# Altium schematic sheet 425AK01A_S01.SchDoc
size A3; DocumentNumber: 1; SheetNumber: 1; SheetTotal: 10; PageSetup: Record=PageOptions|CenterHorizontal=True|CenterVertical=True|PrintScale=1.01|XCorrection=1.00|YCorrection=1.00|PrintKind=1|BorderSize=5000000|LeftOffset=0|BottomOffset=0|Orientation=2|PaperLength=1000|PaperWidth=1000|Scale=100|PaperSource=15|PrintQuality=600|MediaType=1|DitherType=10|PaperKind=A3|PrintScaleMode=1; 00_Drawn: RJG; 00_Date: 8APR2022; 00_Checked: SR; 00_Approved: GN; 00_Line1: Top Level
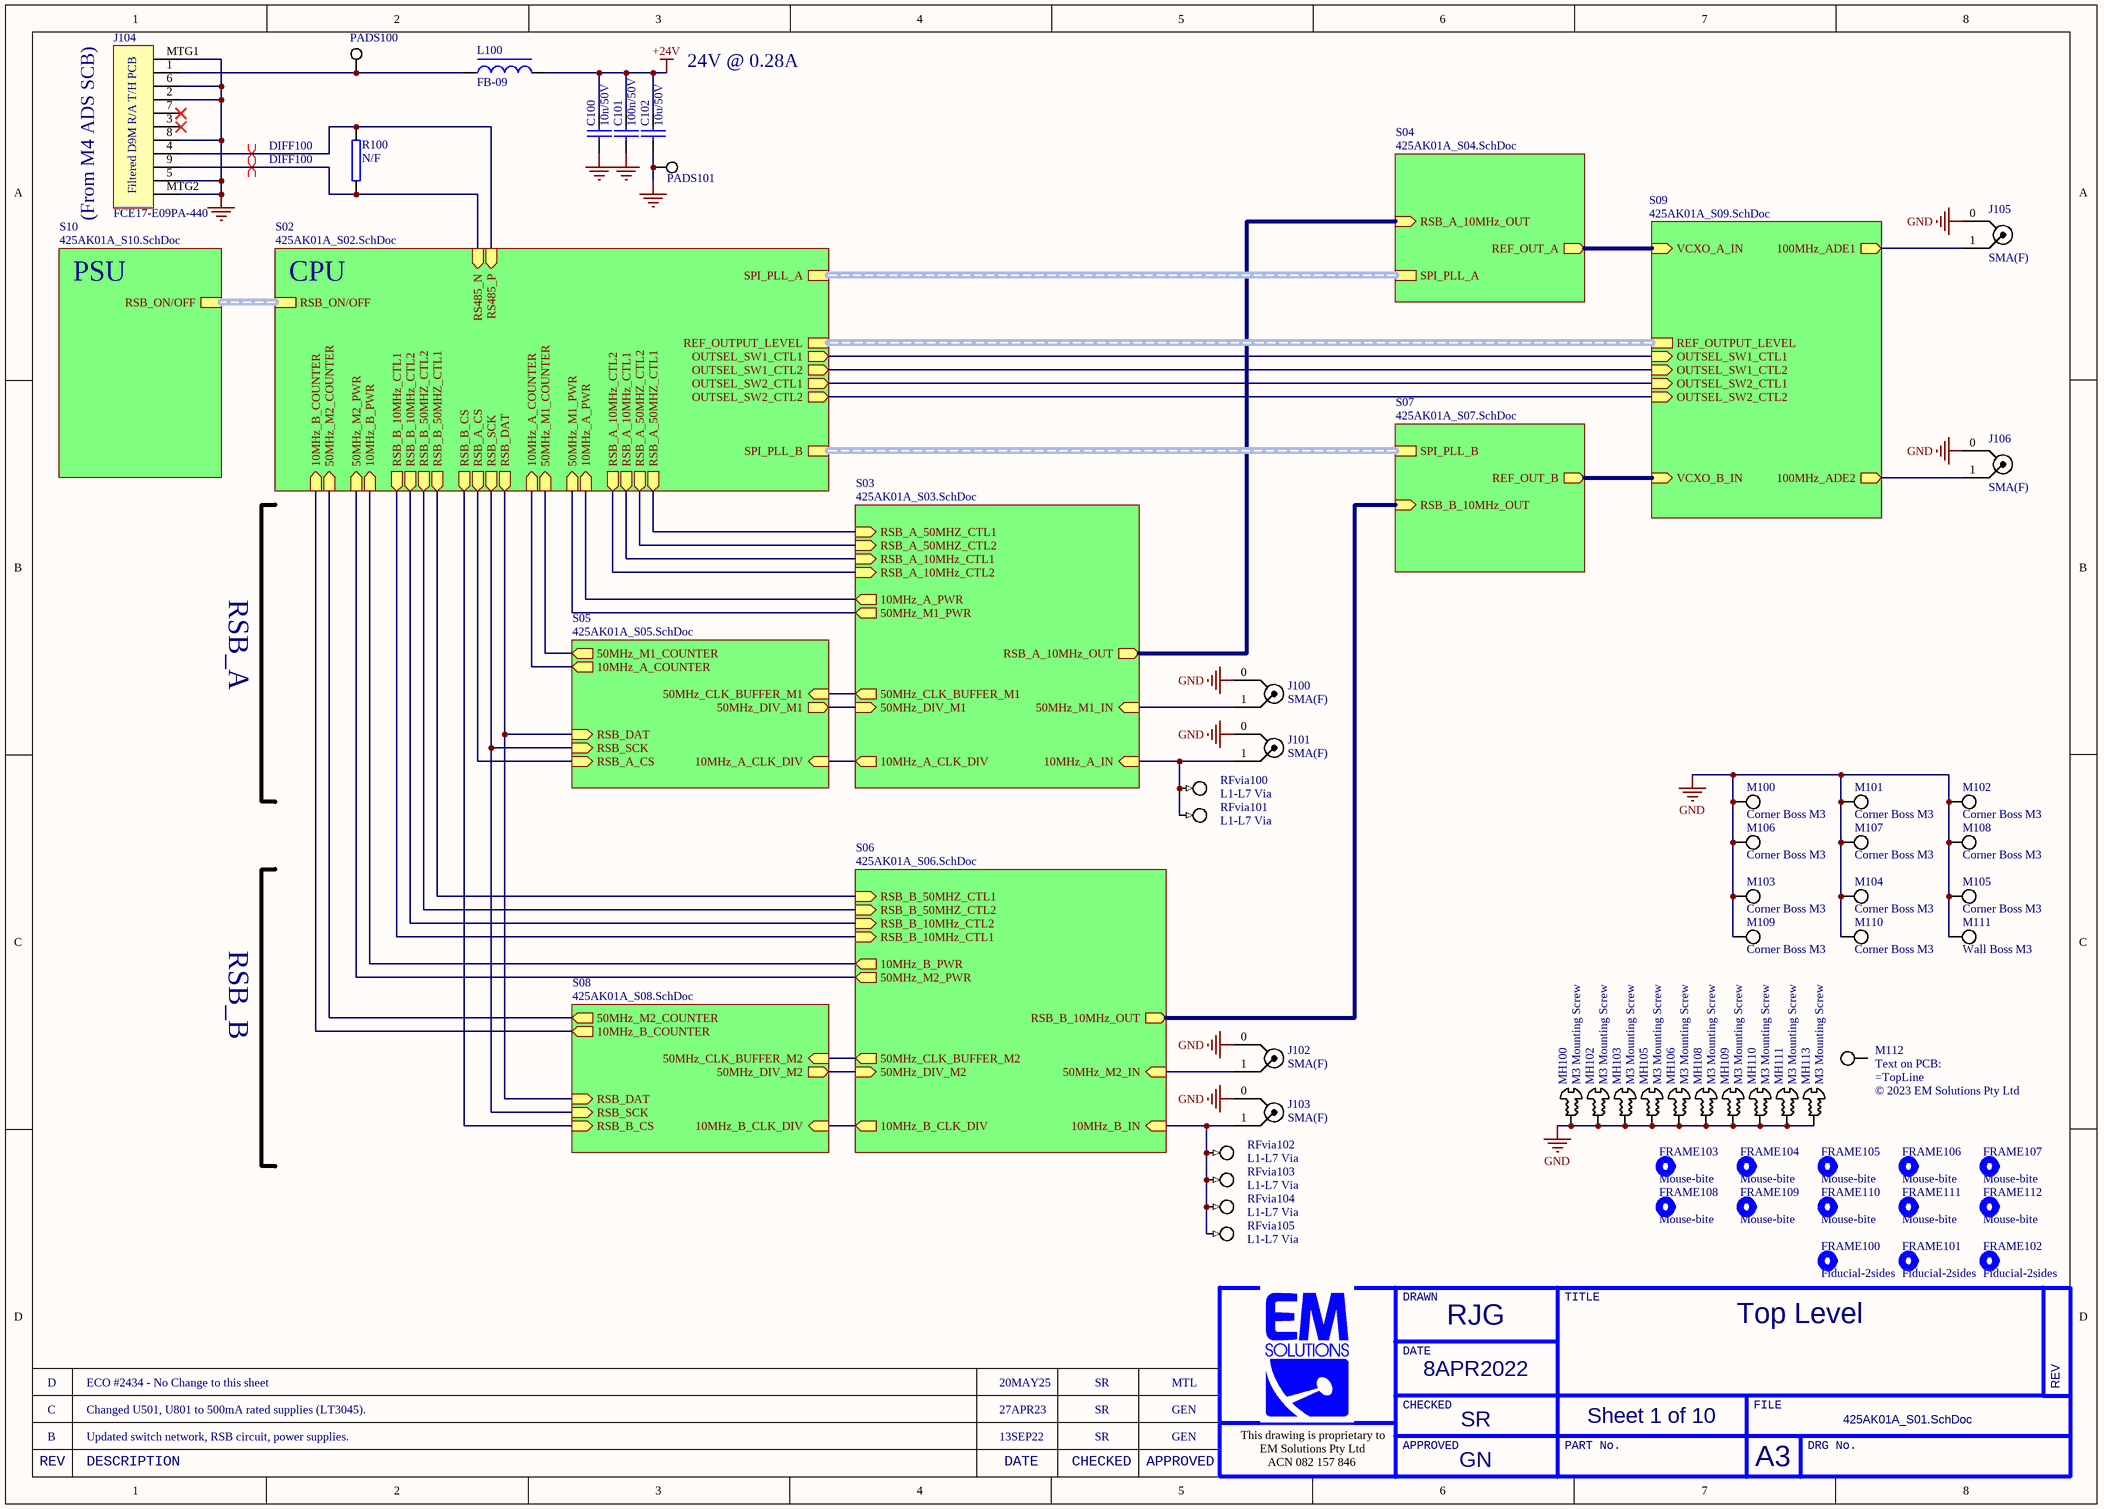
[diagram p0: 425AK01A_S01.SchDoc]

## Parts
C100  10n/50V  [0402C]
C101  100n/50V  [0402C]
C102  10u/50V  [1206C]
FRAME100  Fiducial-2sides  [Fiducial-2layers]  (no BOM)
FRAME101  Fiducial-2sides  [Fiducial-2layers]  (no BOM)
FRAME102  Fiducial-2sides  [Fiducial-2layers]  (no BOM)
FRAME103  Mouse-bite  [Breakout-3hole]  (no BOM)
FRAME104  Mouse-bite  [Breakout-3hole]  (no BOM)
FRAME105  Mouse-bite  [Breakout-3hole]  (no BOM)
FRAME106  Mouse-bite  [Breakout-3hole]  (no BOM)
FRAME107  Mouse-bite  [Breakout-3hole]  (no BOM)
FRAME108  Mouse-bite  [Breakout-3hole]  (no BOM)
FRAME109  Mouse-bite  [Breakout-3hole]  (no BOM)
FRAME110  Mouse-bite  [Breakout-3hole]  (no BOM)
FRAME111  Mouse-bite  [Breakout-3hole]  (no BOM)
FRAME112  Mouse-bite  [Breakout-3hole]  (no BOM)
J100  SMA(F)  [SMA-flange-generic]  (no BOM)
J101  SMA(F)  [SMA-flange-generic]  (no BOM)
J102  SMA(F)  [SMA-flange-generic]  (no BOM)
J103  SMA(F)  [SMA-flange-generic]  (no BOM)
J104  FCE17-E09PA-440  [Connector-D9-M-Filtered-T/H]
J105  SMA(F)  [SMA-flange-generic]  (no BOM)
J106  SMA(F)  [SMA-flange-generic]  (no BOM)
L100  FB-09  [0805L]
M100  Corner Boss M3  [Boss-corner-M3]  (no BOM)
M101  Corner Boss M3  [Boss-corner-M3]  (no BOM)
M102  Corner Boss M3  [Boss-corner-M3-rev]  (no BOM)
M103  Corner Boss M3  [Boss-corner-M3-rev]  (no BOM)
M104  Corner Boss M3  [Boss-corner-M3]  (no BOM)
M105  Corner Boss M3  [Boss-corner-M3-rev]  (no BOM)
M106  Corner Boss M3  [Boss-corner-M3]  (no BOM)
M107  Corner Boss M3  [Boss-corner-M3]  (no BOM)
M108  Corner Boss M3  [Boss-corner-M3]  (no BOM)
M109  Corner Boss M3  [Boss-corner-M3]  (no BOM)
M110  Corner Boss M3  [Boss-corner-M3]  (no BOM)
M111  Wall Boss M3  [Boss-Wall]  (no BOM)
M112  Text on PCB:  [PCB-title-V2-3mm]  (value not drawn)  (no BOM)
MH100  M3 Mounting Screw  [M3_SCREW]  (no BOM)
MH102  M3 Mounting Screw  [M3_SCREW]  (no BOM)
MH103  M3 Mounting Screw  [M3_SCREW]  (no BOM)
MH105  M3 Mounting Screw  [M3_SCREW]  (no BOM)
MH106  M3 Mounting Screw  [M3_SCREW]  (no BOM)
MH108  M3 Mounting Screw  [M3_SCREW]  (no BOM)
MH109  M3 Mounting Screw  [M3_SCREW]  (no BOM)
MH110  M3 Mounting Screw  [M3_SCREW]  (no BOM)
MH111  M3 Mounting Screw  [M3_SCREW]  (no BOM)
MH113  M3 Mounting Screw  [M3_SCREW]  (no BOM)
PADS100  Pads  [Pads-1x3-V3-0.3/0.6mm]  (value not drawn)  (net tie, no BOM)
PADS101  Pads  [Pads-1x3-V3-0.3/0.6mm]  (value not drawn)  (net tie, no BOM)
R100  N/F  [0805]
RFvia100  L1-L7 Via  [RFvia_L1-L7]  (no BOM)
RFvia101  L1-L7 Via  [RFvia_L1-L7]  (no BOM)
RFvia102  L1-L7 Via  [RFvia_L1-L7]  (no BOM)
RFvia103  L1-L7 Via  [RFvia_L1-L7]  (no BOM)
RFvia104  L1-L7 Via  [RFvia_L1-L7]  (no BOM)
RFvia105  L1-L7 Via  [RFvia_L1-L7]  (no BOM)

## Sub-sheets
S02 = 425AK01A_S02.SchDoc: SPI_PLL_B (harness SPI_PLL), REF_OUTPUT_LEVEL (harness REF_OUTPUT_LEVEL), SPI_PLL_A (harness SPI_PLL), RSB_ON/OFF (harness RSB_ON/OFF), 50MHz_M1_COUNTER (in), 10MHz_A_COUNTER (in), RSB_DAT (out), RSB_SCK (out), RSB_A_CS (out), RSB_B_CS (out), 10MHz_B_COUNTER (in), 50MHz_M1_PWR (in), 10MHz_A_PWR (in), RSB_A_10MHz_CTL2 (out), RSB_A_10MHz_CTL1 (out), RSB_A_50MHZ_CTL2 (out), RSB_A_50MHZ_CTL1 (out), 50MHz_M2_COUNTER (in), RSB_B_50MHZ_CTL1 (out), RSB_B_50MHZ_CTL2 (out), RSB_B_10MHz_CTL2 (out), RSB_B_10MHz_CTL1 (out), 10MHz_B_PWR (in), 50MHz_M2_PWR (in), RS485_N (in), RS485_P (in), OUTSEL_SW1_CTL1 (out), OUTSEL_SW2_CTL2 (out), OUTSEL_SW2_CTL1 (out), OUTSEL_SW1_CTL2 (out)
S03 = 425AK01A_S03.SchDoc: RSB_A_10MHz_OUT (out), 50MHz_CLK_BUFFER_M1 (out), 10MHz_A_PWR (out), 10MHz_A_CLK_DIV (out), 50MHz_M1_PWR (out), 50MHz_M1_IN (in), 50MHz_DIV_M1 (in), RSB_A_50MHZ_CTL1 (in), RSB_A_50MHZ_CTL2 (in), RSB_A_10MHz_CTL1 (in), RSB_A_10MHz_CTL2 (in), 10MHz_A_IN (in)
S04 = 425AK01A_S04.SchDoc: SPI_PLL_A (harness SPI_PLL), RSB_A_10MHz_OUT (in), REF_OUT_A (out)
S05 = 425AK01A_S05.SchDoc: 10MHz_A_COUNTER (out), 50MHz_M1_COUNTER (out), 50MHz_DIV_M1 (out), 10MHz_A_CLK_DIV (in), 50MHz_CLK_BUFFER_M1 (in), RSB_A_CS (in), RSB_DAT (in), RSB_SCK (in)
S06 = 425AK01A_S06.SchDoc: RSB_B_10MHz_OUT (out), 10MHz_B_IN (in), RSB_B_50MHZ_CTL1 (in), RSB_B_10MHz_CTL2 (in), RSB_B_10MHz_CTL1 (in), 10MHz_B_CLK_DIV (out), 10MHz_B_PWR (out), RSB_B_50MHZ_CTL2 (in), 50MHz_M2_PWR (out), 50MHz_CLK_BUFFER_M2 (out), 50MHz_M2_IN (in), 50MHz_DIV_M2 (in)
S07 = 425AK01A_S07.SchDoc: SPI_PLL_B (harness SPI_PLL), RSB_B_10MHz_OUT (in), REF_OUT_B (out)
S08 = 425AK01A_S08.SchDoc: RSB_DAT (in), 10MHz_B_CLK_DIV (in), 10MHz_B_COUNTER (out), RSB_B_CS (in), RSB_SCK (in), 50MHz_M2_COUNTER (out), 50MHz_DIV_M2 (out), 50MHz_CLK_BUFFER_M2 (in)
S09 = 425AK01A_S09.SchDoc: REF_OUTPUT_LEVEL (harness REF_OUTPUT_LEVEL), VCXO_A_IN (in), VCXO_B_IN (in), 100MHz_ADE2 (out), 100MHz_ADE1 (out), OUTSEL_SW2_CTL1 (in), OUTSEL_SW1_CTL2 (in), OUTSEL_SW2_CTL2 (in), OUTSEL_SW1_CTL1 (in)
S10 = 425AK01A_S10.SchDoc: RSB_ON/OFF (harness RSB_ON/OFF)

## Nets
+24V: C100.1 C101.1 C102.1 L100.2
GND: C100.2 C101.2 C102.2 J100.0 J101.0 J102.0 J103.0 J104.2 J104.5 J104.6 J104.8 J104.MTG1 J104.MTG2 J105.0 J106.0 M100.1 M101.1 M102.1 M103.1 M104.1 M105.1 M106.1 M107.1 M108.1 M109.1 M110.1 M111.1 MH100.1 MH102.1 MH103.1 MH105.1 MH106.1 MH108.1 MH109.1 MH110.1 MH111.1 MH113.1 PADS101.1
NetJ100_1: J100.1 ; sheet S03/50MHz_M1_IN
NetJ101_1: J101.1 RFvia100.1 RFvia101.1 ; sheet S03/10MHz_A_IN
NetJ102_1: J102.1 ; sheet S06/50MHz_M2_IN
NetJ103_1: J103.1 RFvia102.1 RFvia103.1 RFvia104.1 RFvia105.1 ; sheet S06/10MHz_B_IN
NetJ104_1: J104.1 L100.1 PADS100.1
NetJ104_4: J104.4 R100.2 ; sheet S02/RS485_P
NetJ104_9: J104.9 R100.1 ; sheet S02/RS485_N
NetJ105_1: J105.1 ; sheet S09/100MHz_ADE1
NetJ106_1: J106.1 ; sheet S09/100MHz_ADE2
(unnamed): sheet S04/RSB_A_10MHz_OUT, sheet S03/RSB_A_10MHz_OUT
(unnamed): sheet S04/REF_OUT_A, sheet S09/VCXO_A_IN
(unnamed): sheet S07/RSB_B_10MHz_OUT, sheet S06/RSB_B_10MHz_OUT
(unnamed): sheet S07/REF_OUT_B, sheet S09/VCXO_B_IN
(unnamed): sheet S09/OUTSEL_SW2_CTL1, sheet S02/OUTSEL_SW2_CTL1
(unnamed): sheet S09/OUTSEL_SW1_CTL2, sheet S02/OUTSEL_SW1_CTL2
(unnamed): sheet S09/OUTSEL_SW2_CTL2, sheet S02/OUTSEL_SW2_CTL2
(unnamed): sheet S09/OUTSEL_SW1_CTL1, sheet S02/OUTSEL_SW1_CTL1
(unnamed): sheet S02/50MHz_M1_COUNTER, sheet S05/50MHz_M1_COUNTER
(unnamed): sheet S02/10MHz_A_COUNTER, sheet S05/10MHz_A_COUNTER
(unnamed): sheet S02/RSB_DAT, sheet S05/RSB_DAT, sheet S08/RSB_DAT
(unnamed): sheet S02/RSB_SCK, sheet S05/RSB_SCK, sheet S08/RSB_SCK
(unnamed): sheet S02/RSB_A_CS, sheet S05/RSB_A_CS
(unnamed): sheet S02/RSB_B_CS, sheet S08/RSB_B_CS
(unnamed): sheet S02/10MHz_B_COUNTER, sheet S08/10MHz_B_COUNTER
(unnamed): sheet S02/50MHz_M1_PWR, sheet S03/50MHz_M1_PWR
(unnamed): sheet S02/10MHz_A_PWR, sheet S03/10MHz_A_PWR
(unnamed): sheet S02/RSB_A_10MHz_CTL2, sheet S03/RSB_A_10MHz_CTL2
(unnamed): sheet S02/RSB_A_10MHz_CTL1, sheet S03/RSB_A_10MHz_CTL1
(unnamed): sheet S02/RSB_A_50MHZ_CTL2, sheet S03/RSB_A_50MHZ_CTL2
(unnamed): sheet S02/RSB_A_50MHZ_CTL1, sheet S03/RSB_A_50MHZ_CTL1
(unnamed): sheet S02/50MHz_M2_COUNTER, sheet S08/50MHz_M2_COUNTER
(unnamed): sheet S02/RSB_B_50MHZ_CTL1, sheet S06/RSB_B_50MHZ_CTL1
(unnamed): sheet S02/RSB_B_50MHZ_CTL2, sheet S06/RSB_B_50MHZ_CTL2
(unnamed): sheet S02/RSB_B_10MHz_CTL2, sheet S06/RSB_B_10MHz_CTL2
(unnamed): sheet S02/RSB_B_10MHz_CTL1, sheet S06/RSB_B_10MHz_CTL1
(unnamed): sheet S02/10MHz_B_PWR, sheet S06/10MHz_B_PWR
(unnamed): sheet S02/50MHz_M2_PWR, sheet S06/50MHz_M2_PWR
(unnamed): sheet S03/50MHz_CLK_BUFFER_M1, sheet S05/50MHz_CLK_BUFFER_M1
(unnamed): sheet S03/10MHz_A_CLK_DIV, sheet S05/10MHz_A_CLK_DIV
(unnamed): sheet S03/50MHz_DIV_M1, sheet S05/50MHz_DIV_M1
(unnamed): sheet S06/10MHz_B_CLK_DIV, sheet S08/10MHz_B_CLK_DIV
(unnamed): sheet S06/50MHz_CLK_BUFFER_M2, sheet S08/50MHz_CLK_BUFFER_M2
(unnamed): sheet S06/50MHz_DIV_M2, sheet S08/50MHz_DIV_M2

Not connected (* = marked no-connect by the designer): J104 3* 7*; M112 1

## Buses and harness runs
harness sheet S02/REF_OUTPUT_LEVEL = sheet S09/REF_OUTPUT_LEVEL
harness sheet S02/RSB_ON/OFF = sheet S10/RSB_ON/OFF
harness sheet S02/SPI_PLL_A = sheet S04/SPI_PLL_A
harness sheet S02/SPI_PLL_B = sheet S07/SPI_PLL_B

## Layout directives
differential pair; differential pair class DIFF100; Parameter 1: DIFF100: NetJ104_4, NetJ104_9

## Notes on the sheet
- 24V @ 0.28A
- (From M4 ADS SCB)
- PSU
- CPU
- RSB_A
- RSB_B
- D
- ECO #2434 - No Change to this sheet
- 20MAY25
- SR
- MTL
- B
- C
- Updated switch network, RSB circuit, power supplies.
- Changed U501, U801 to 500mA rated supplies (LT3045).
- 13SEP22
- 27APR23
- GEN
- DRAWN
- TITLE
- DATE
- REV
- This drawing is proprietary to
- EM Solutions Pty Ltd
- APPROVED
- CHECKED
- PART No.
- FILE
- A3
- DRG No.
- DESCRIPTION
- ACN 082 157 846
- (in symbol Connector-D9-M-Filtered-T/H_PCBorder) Filtered D9M R/A T/H PCB

## Library data of the parts
C100 = 41-010N-12: Capacitor, 0402, 10n X7R 10% 50V Ceramic, NiSn; MANUFACTURER: MURATA; MODELNAME: GCM155R71H103KA55D; ID: 2217; Part Number: 41-010N-12; ItemID: 41-010N-12
C101 = 41-100N-13: Capacitor, 0402, 100n, X7R, 10% 50V, Ceramic; MANUFACTURER: MURATA; MODELNAME: GRM155R71H104KE14J; ID: 2441; Part Number: 41-100N-13; ItemID: 41-100N-13
C102 = 41-010U-13: Capacitor, 1206, 10u X7R 10% 50V Ceramic, NiSn; MANUFACTURER: SAMSUNG; MODELNAME: CL31B106KBHNNNE; ID: 2237; Part Number: 41-010U-13; ItemID: 41-010U-13
FRAME100-FRAME102 = Fiducial-2sides: Fiducial on both sides of the PCB
FRAME103-FRAME112 = Breakout: Add design rule: / BoardOutlineClearance_Breakouts, name like 'FRAME*-NoDRC', 0
J100-J103 J105 J106 = Connector-SMA-edge: Generic SMA bulkhead connector. Grounding via chassis.; Part Number: 30-P-01
J104 = Connector-D9-M-Filtered-T/H_PCBorder: Amphenol FCE17-E09PA-440 D9M Filtered R/A T/H connector; Part Number: 20-D9-10
L100 = 46-B-09: Solid Inductor, 1000ohm@100MHz, DCR=0.15, 1A, 0805 size; MANUFACTURER: LAIRD; MODELNAME: MI0805J102R-10; ID: 3254; Part Number: 46-B-09; ItemID: 46-B-09
M100-M110 = Boss-Corner-M3
M111 = Boss-M3-Wall
M112 = Title of PCB: Edit parameter "MidLine" to insert the name of the PCB. / NOTE: Update copyright year as needed.; MidLine: © 2023 EM Solutions Pty Ltd; TopLine: ='P/N: 04-'+ProductNo+'-'+ItemNo+' Rev '+ItemRev
MH100 MH102 MH103 MH105 MH106 MH108-MH111 MH113 = M3 Screw
PADS100 PADS101 = Pads: Cluster of pads
R100 = 44-N/F-09: Resistor, 0805, SOT, Not Fitted; MANUFACTURER: PHILIPS; ID: 3110; MODELNAME: RC12H; Part Number: 44-N/F-09; ItemID: 44-N/F-09
RFvia100-RFvia105 = RFvia_L1-L7: RF Via from layer 1 to layer 7, on an 8-layer board.; Rule: UNIONINDEX=0|RULEKIND=PlaneClearance|NETSCOPE=AnyNet|LAYERKIND=SameLayer|NAME=Schematic Power Plane Clearance|CLEARANCE=13.7795mil|UNIT=Imperial